# EAGLE schematic esp-12_ulsp_smart-button_full-setup (EAGLE 7.3.0)
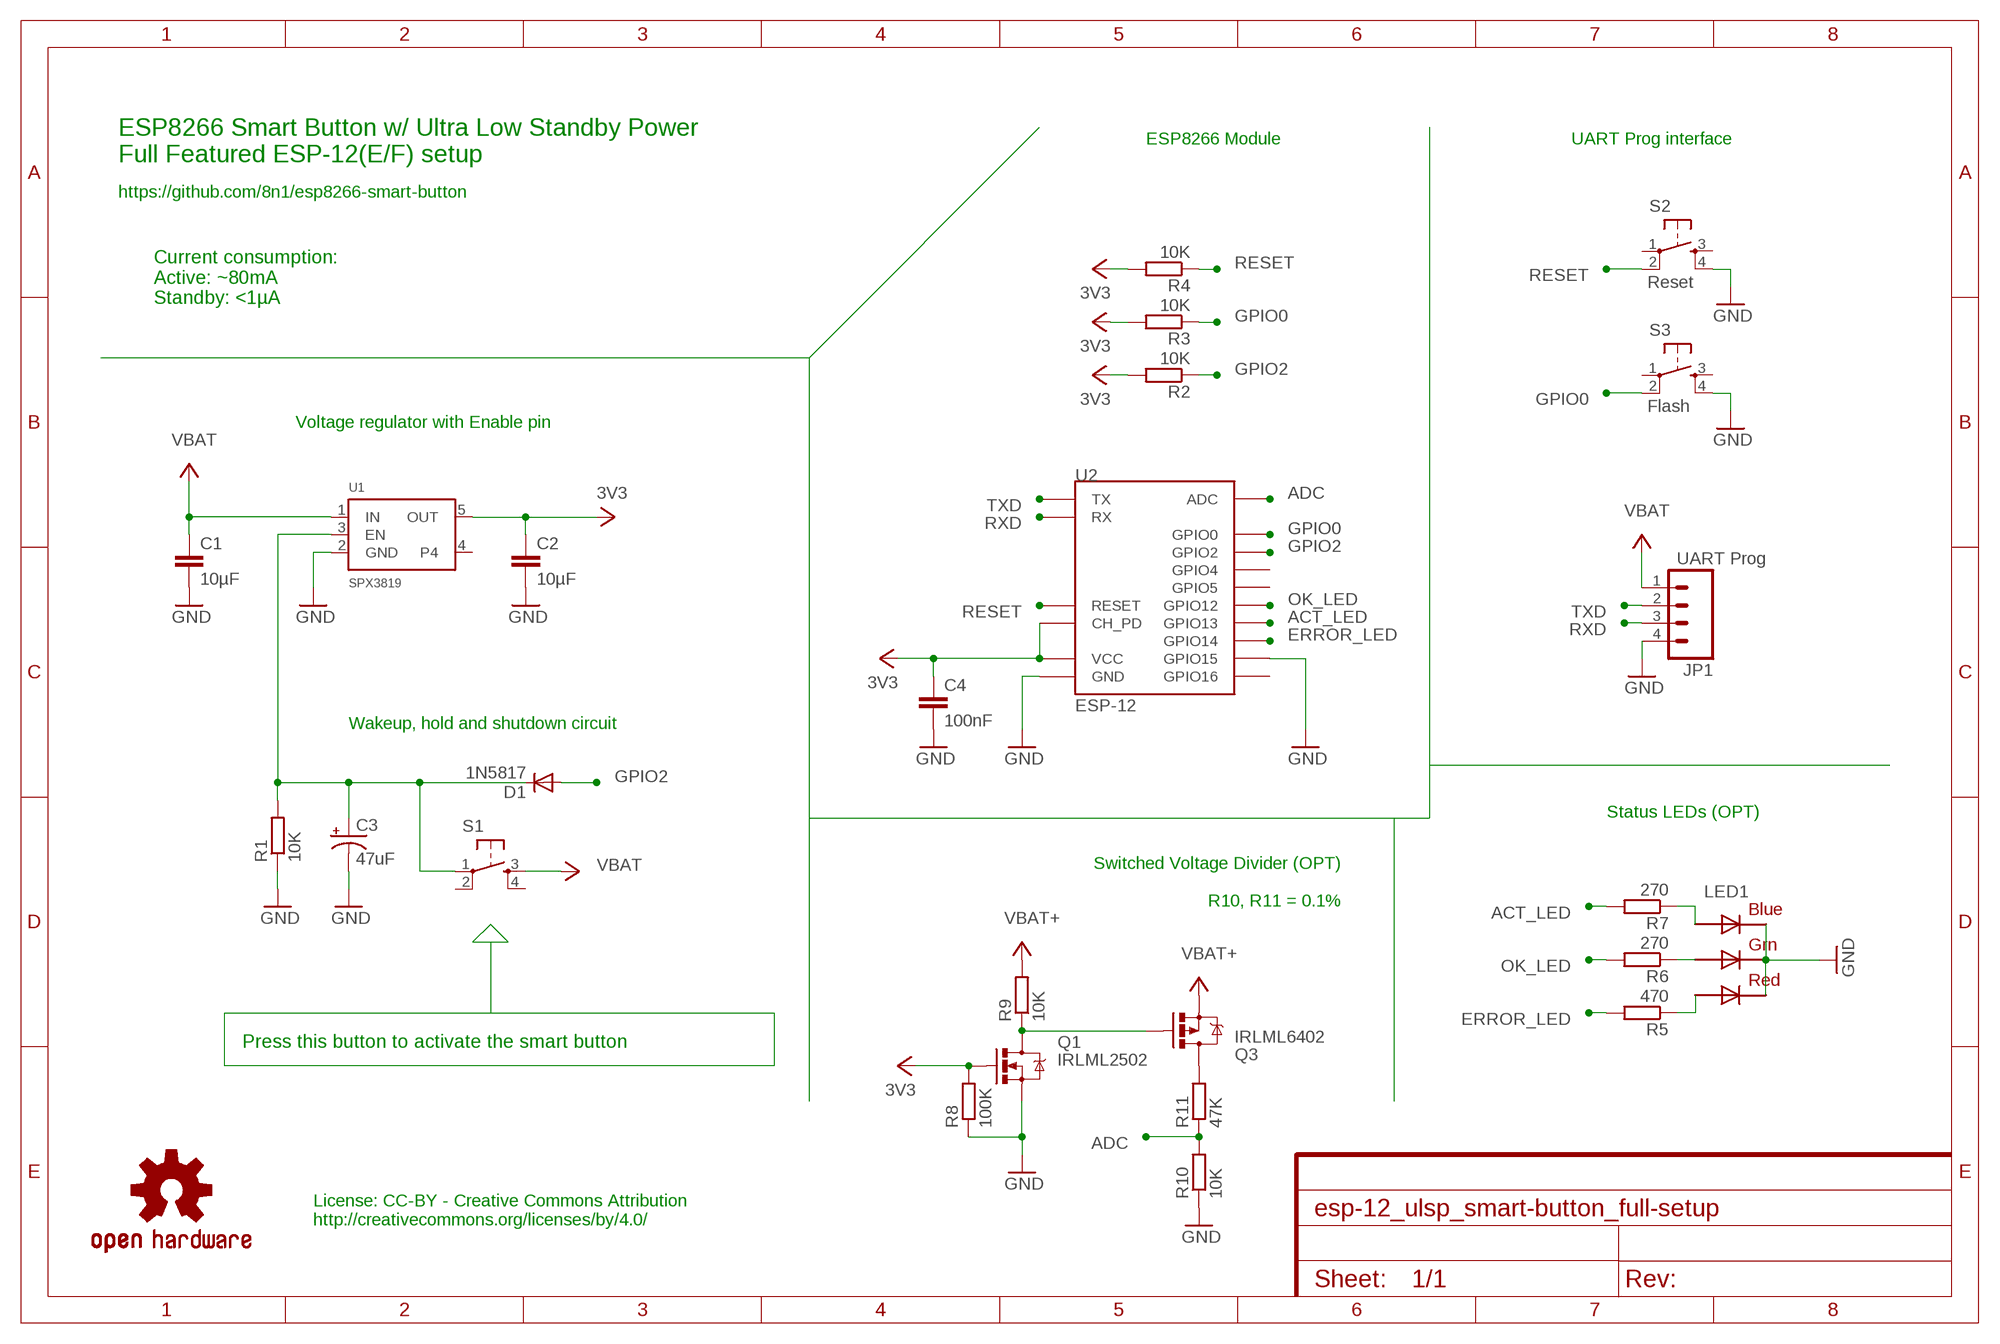
[diagram p0: schematic, sheet 1]
FRAME1 (FRAME-A4L): CNAME: ESP8266 Smart Button w/ ULSP - V2; CREVISION: A; DESIGNER: JohSka [8N1]

## Parts
C1  10µF  C-EUC0805  [C0805]
C2  10µF  C-EUC0805  [C0805]
C3  47uF  100UF-63V-20%(ELECT)  [NIC_10X10.5_CAP]
C4  100nF  C-EUC0805  [C0805]
D1  1N5817  DIODE-DO-214AC  [DO-214AC]
JP1  UART Prog  M04PTH  [1X04]
LED1  RGBLED5050  [RGBLED5050]
Q1  IRLML2502  MOSFET-NCHANNELSMD  [SOT23-3]
Q3  IRLML6402  MOSFET-PCHANNELSMD  [SOT23-3]
R1  10K  R-EU_R0805  [R0805]
R2  10K  R-EU_R0805  [R0805]
R3  10K  R-EU_R0805  [R0805]
R4  10K  R-EU_R0805  [R0805]
R5  470  R-EU_R0805  [R0805]
R6  270  R-EU_R0805  [R0805]
R7  270  R-EU_R0805  [R0805]
R8  100K  R-EU_R0805  [R0805]
R9  10K  R-EU_R0805  [R0805]
R10  10K  R-EU_R0805  [R0805]
R11  47K  R-EU_R0805  [R0805]
S1  TACTILE-SWITCH-PTH  [TAC-SWITCH-PTH]
S2  Reset  TACTILE-SWITCH-PTH  [TAC-SWITCH-PTH]
S3  Flash  TACTILE-SWITCH-PTH  [TAC-SWITCH-PTH]
U1  SPX3819  VREG_SOT23-5  [SOT23-5]
U2  ESP-12  [ESP-12]
U$2  OSHW-LOGOL  [OSHW-LOGO-L]

## Nets
3V3: C2.1 C4.1 Q1.1(G) R2.2 R3.2 R4.2 R8.2 U1.5(OUT) U2.CH_PD U2.VCC
#4: Q1.3(D) Q3.1(G) R9.1
ACT_LED: R7.2 U2.GPIO13
ADC: R10.2 R11.1 U2.ADC
ERROR_LED: R5.2 U2.GPIO14
GND: C1.2 C2.2 C3.- C4.2 JP1.4 LED1.4(BLUE_C) LED1.5(RED_C) LED1.6(GREEN_C) Q1.2(S) R1.1 R8.1 R10.1 S2.4 S3.4 U1.2(GND) U2.GND U2.GPIO15
GPIO0: R3.1 S3.2 U2.GPIO0
GPIO2: D1.2(A) R2.1 U2.GPIO2
LDO_EN: C3.+ D1.1(C) R1.2 S1.1 U1.3(EN)
N$3: LED1.1(GREEN_A) R6.1
N$4: LED1.3(BLUE_A) R7.1
N$5: LED1.2(RED_A) R5.1
OK_LED: R6.2 U2.GPIO12
RESET: R4.1 S2.2 U2.RESET
RXD: JP1.3 U2.RX
SWITCHED_VBAT: Q3.3(D) R11.2
TXD: JP1.2 U2.TX
VBAT: C1.1 U1.1(IN)
VBAT+: Q3.2(S) R9.2 ; supply symbol labelled VBAT
VCC: JP1.1 S1.3 ; supply symbol labelled VBAT
Unconnected: S1.2 S1.4 S2.1 S2.3 S3.1 S3.3 U1.4 U2.GPIO4 U2.GPIO5 U2.GPIO16

## Notes on the sheet
- ESP8266 Module | UART Prog interface
- ESP8266 Smart Button w/ Ultra Low Standby Power
  Full Featured ESP-12(E/F) setup
- https://github.com/8n1/esp8266-smart-button
- Current consumption:
  Active: ~80mA
  Standby: <1µA
- Voltage regulator with Enable pin
- Wakeup, hold and shutdown circuit
- Status LEDs (OPT)
- Switched Voltage Divider (OPT)
  
  R10, R11 = 0.1%
- Press this button to activate the smart button
- License: CC-BY - Creative Commons Attribution
  http://creativecommons.org/licenses/by/4.0/

## Library data of the parts
C1 C2 C4 = resistor:C-EU: CAPACITOR, European symbol
C3 = SparkFun-Capacitors:100UF-63V-20%(ELECT): CAP-08362 100uF electrolytic SMT 63V 20%; PROD_ID: CAP-08362; VALUE: 100uF
D1 = dp-devices:DIODE: Various Diode Packages
JP1 = SparkFun:M04: Header 4 Standard 4-pin 0.1" header. Use with straight break away headers (SKU : PRT-00116), right angle break away headers (PRT-00553), swiss pins (PRT-00743), machine pins (PRT-00117), and female headers (PRT-00115). Molex polarized connector foot print use with SKU : PRT-08231 with associated crimp pins and housings. 1MM SMD Version SKU: PRT-10208
LED1 = adafruit:RGBLED: For 5050 RGB LEDs, the order of the LEDs may vary from one manufacturer to another!
Q1 = SparkFun:MOSFET-NCHANNEL
Q3 = SparkFun:MOSFET-PCHANNEL
R1-R11 = resistor:R-EU_: RESISTOR, European symbol
S1-S3 = GeekAmmo:TACTILE-SWITCH: Tactile Switch 4 Pins, SPST NO
U1 = microbuilder:VREG_SOT23-5: SOT23-5 Fixed Voltage Regulators To better organise some of the SOT23-5 fixed voltage regulators in this library, this new part was created. Part Current Out V Out V In V Dropout Digikey Part No. ADP121 150mA 3.3V 3.4-5.5V 0.09V @ 150mA ADP121-AUJZ33R7CT-ND ADP121 150mA 3.0V 3.1-5.5V 0.09V @ 150mA ADP121-AUJZ30R7CT-ND ADP122 300mA 3.3V 3.4-5.5V 0.085V @ 300mA ADP122AUJZ-3.3-R7CT-ND ADP1712 300mA 3.3V 3.5-5.5V 0.17V @ 300mA ADP1712AUJZ-3.3-R7TR-ND AP7311 (Low Cost) 150mA 3.3V 3.5-6V 0.15V @ 150mA AP7311-33WG-7DICT-ND LD39015M18R 150mA 1.8V 1.9V-5.5V 0.08V @ 100mA 497-6977-1-ND MCP1824T-3302E/OT 300mA 3.3V 3.5V-6V 0.2V @ 300mA MCP1824T-3302E/OTCT-ND MIC5205-2.5YM5 TR 150mA 2.5V 2.7-16V 0.165V @ 150mA 576-1257-2-ND MIC5205-3.0YM5 TR 150mA 3.0V 3.2V-16V 0.165V @ 150mA 576-1258-2-ND MIC5205-3.3YM5 TR 150mA 3.3V 3.5V-16V 0.165V @ 150mA 576-1259-2-ND TPS780330220 150mA 3.3V+2.2V 3.6-5.5V 250mV Max 296-23332-1-ND TDA3663/N1,135 100mA 3.3V 3.5-45V 0.18V @ 50mA 568-5343-1-ND
U2 = esp8266modules:ESP-12: ESP8266 Wifi Module ESP-12; DIMENSIONS: 24.0 x 16.0 mm; PINS: 16; PITCH: 0.078" / 2 mm
U$2 = SparkFun:OSHW-LOGO: Open Source Hardware Logo This logo indicates the piece of hardware it is found on incorporates a OSHW license and/or adheres to the definition of open source hardware found here: http://freedomdefined.org/OSHW